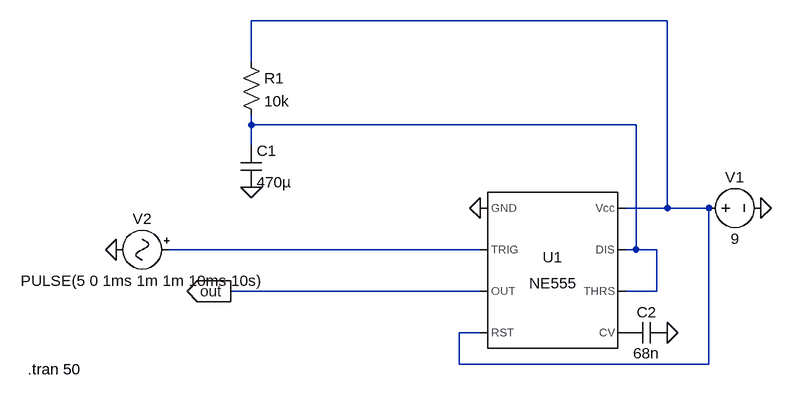
[diagram p0: schematic ne555Monostabil.asc]
ne555Monostabil.asc, the LTspice schematic file:
Version 4.1
SHEET 1 880 680
WIRE 352 -224 -288 -224
WIRE -288 -160 -288 -224
WIRE -288 -64 -288 -80
WIRE 304 -64 -288 -64
WIRE -288 -32 -288 -64
WIRE 352 64 352 -224
WIRE 352 64 288 64
WIRE 416 64 352 64
WIRE 64 128 -416 128
WIRE 304 128 304 -64
WIRE 304 128 288 128
WIRE 336 128 304 128
WIRE 64 192 -320 192
WIRE 336 192 336 128
WIRE 336 192 288 192
WIRE 64 256 32 256
WIRE 32 304 32 256
WIRE 416 304 416 64
WIRE 416 304 32 304
FLAG 64 64 0
FLAG 496 64 0
FLAG -320 192 out
IOPIN -320 192 Out
FLAG -288 32 0
FLAG -496 128 0
FLAG 352 256 0
SYMBOL Misc\\NE555 176 160 R0
SYMATTR InstName U1
SYMBOL voltage 400 64 R270
WINDOW 0 32 56 VTop 2
WINDOW 3 -32 56 VBottom 2
WINDOW 123 0 0 Left 0
WINDOW 39 0 0 Left 0
SYMATTR InstName V1
SYMATTR Value 9
SYMBOL cap -304 -32 R0
SYMATTR InstName C1
SYMATTR Value 470µ
SYMBOL res -304 -176 R0
SYMATTR InstName R1
SYMATTR Value 10k
SYMBOL Misc\\signal -400 128 R90
WINDOW 0 -32 56 VBottom 2
WINDOW 3 32 56 VTop 2
WINDOW 123 0 0 Left 0
WINDOW 39 0 0 Left 0
SYMATTR InstName V2
SYMATTR Value PULSE(5 0 1ms 1m 1m 10ms 10s)
SYMBOL cap 352 240 R90
WINDOW 0 0 32 VBottom 2
WINDOW 3 32 32 VTop 2
SYMATTR InstName C2
SYMATTR Value 68n
TEXT -632 312 Left 2 !.tran 50

The netlist it stands for:
* ne555Monostabil.asc
X§U1 0 N003 out N001 P001 N002 N002 N001 NE555  ; pins GND TRIG OUT RST CV THRS DIS Vcc
V1 N001 0 9
C1 N002 0 470µ
R1 N001 N002 10k
V2 N003 0 PULSE(5 0 1ms 1m 1m 10ms 10s)
C2 0 P001 68n
.tran 50
.lib NE555.sub
.backanno
.end